# Altium schematic sheet Controler.SchDoc
size A3
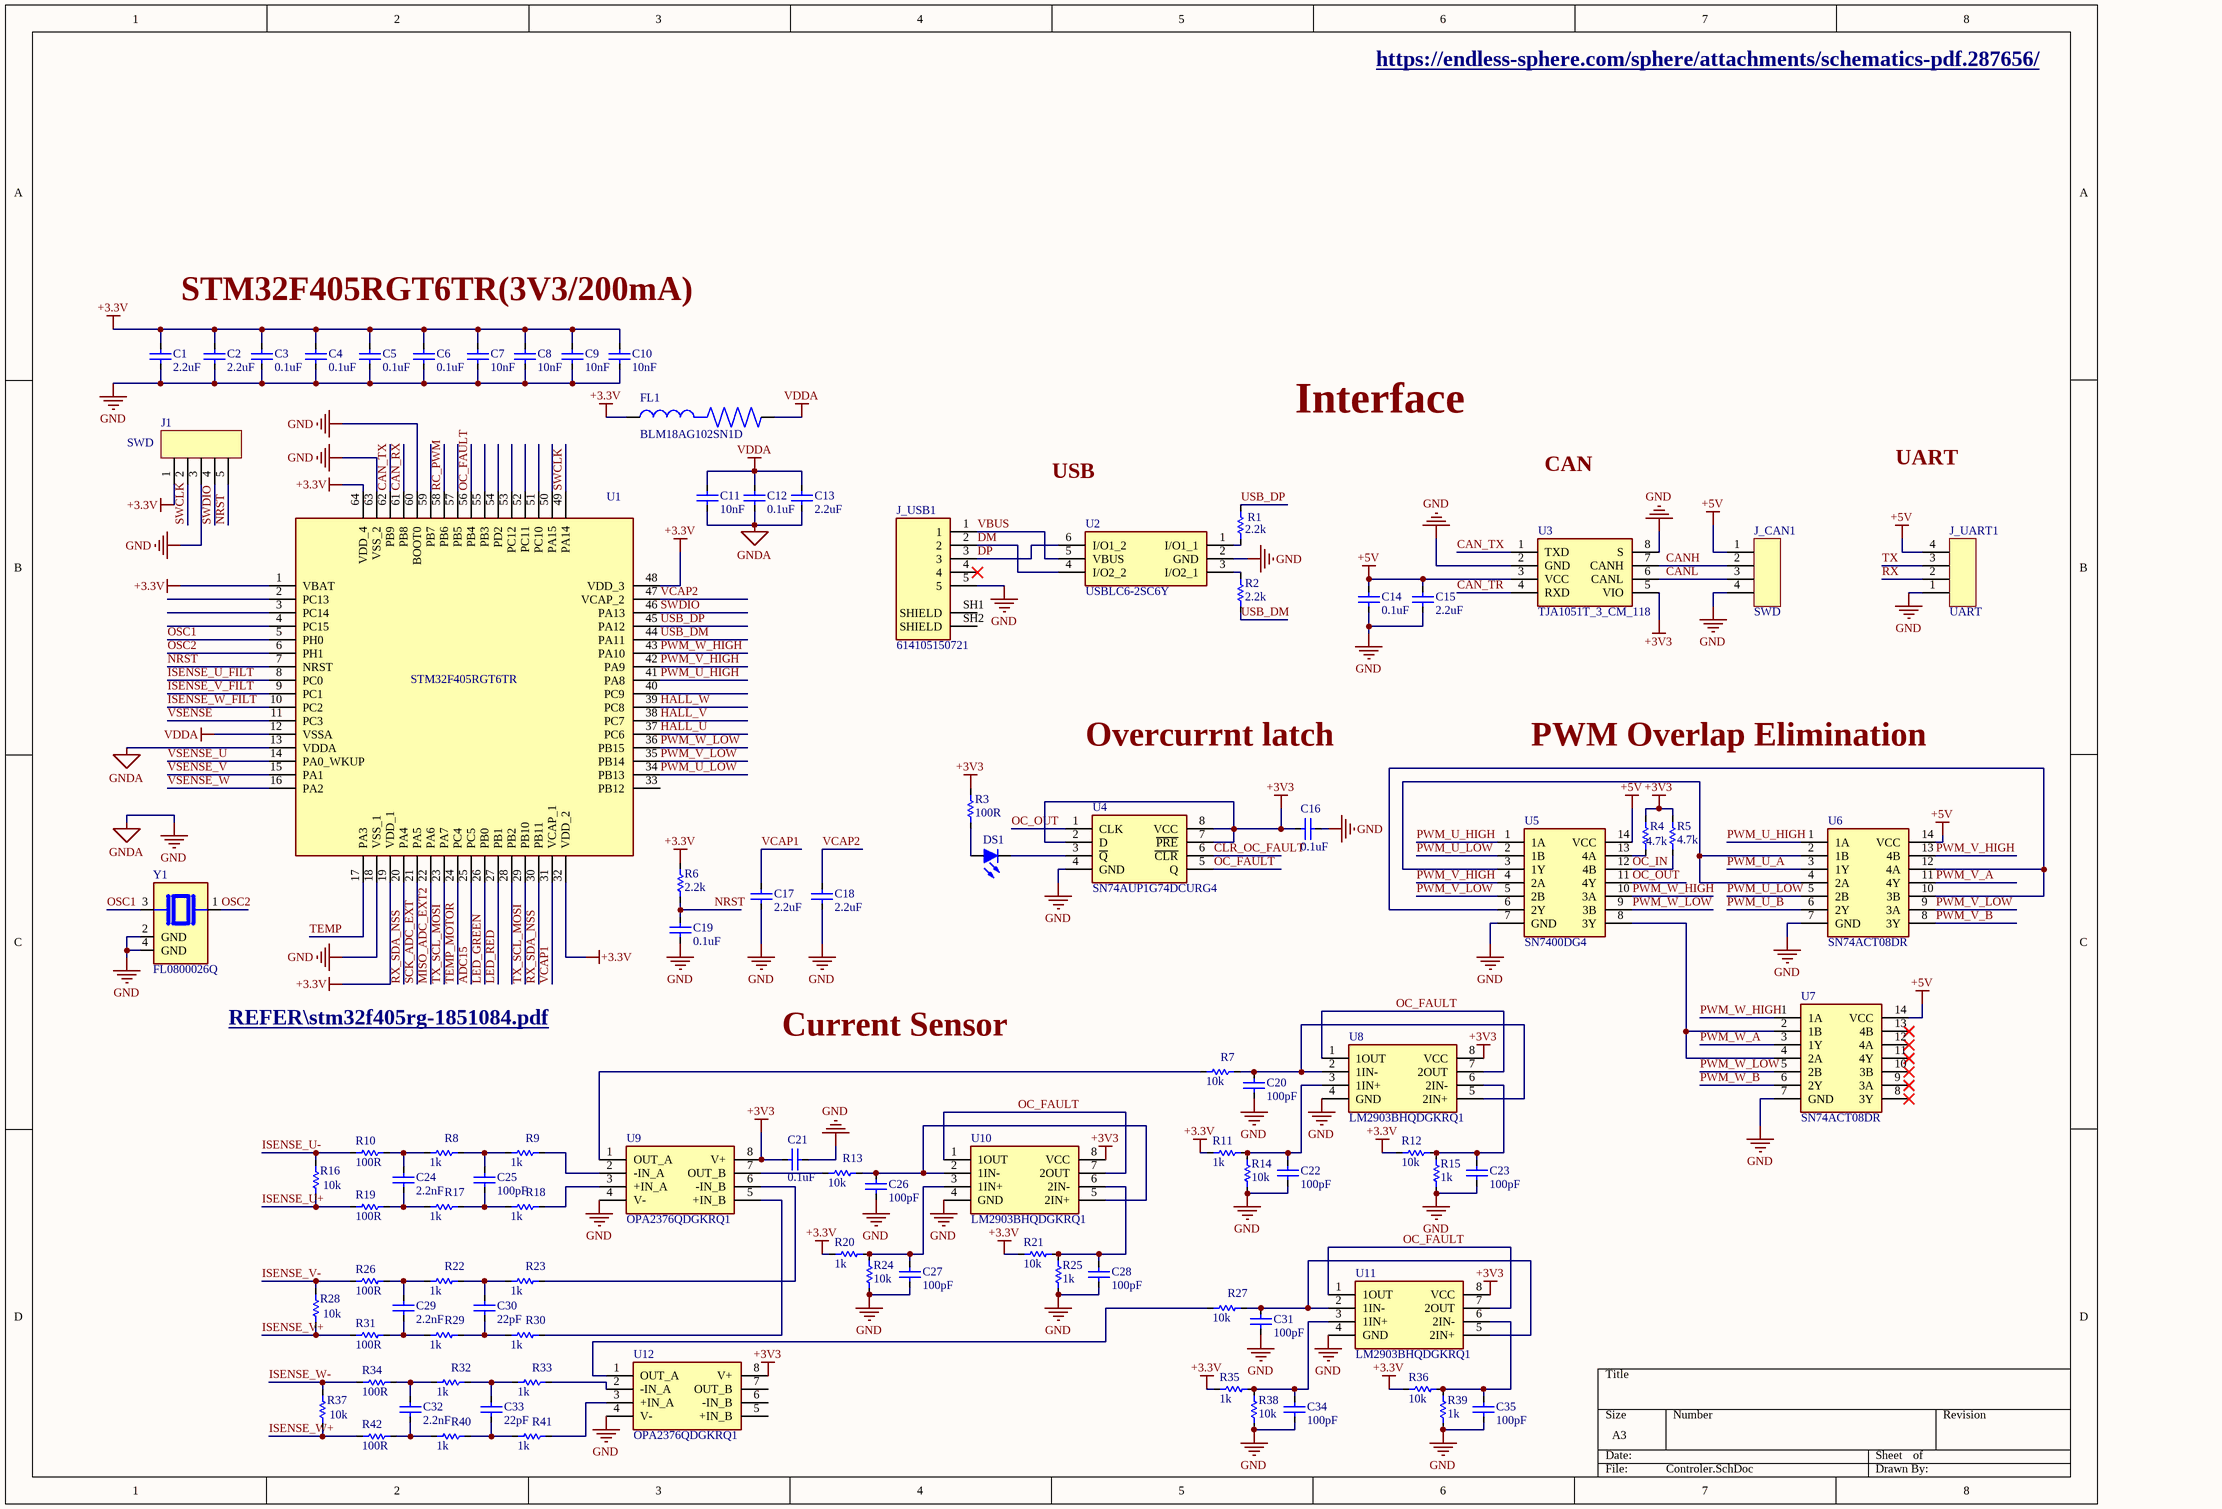
[diagram p0: Controler.SchDoc]

## Parts
C1  2.2uF  [SMD_C(0603)]
C2  2.2uF  [SMD_C(0603)]
C3  0.1uF  [SMD_C(0402)]
C4  0.1uF  [SMD_C(0402)]
C5  0.1uF  [SMD_C(0402)]
C6  0.1uF  [SMD_C(0402)]
C7  10nF  [SMD_C(0402)]
C8  10nF  [SMD_C(0402)]
C9  10nF  [SMD_C(0402)]
C10  10nF  [SMD_C(0402)]
C11  10nF  [SMD_C(0402)]
C12  0.1uF  [SMD_C(0402)]
C13  2.2uF  [SMD_C(0603)]
C14  0.1uF  [SMD_C(0402)]
C15  2.2uF  [SMD_C(0603)]
C16  0.1uF  [SMD_C(0402)]
C17  2.2uF  [SMD_C(0603)]
C18  2.2uF  [SMD_C(0603)]
C19  0.1uF  [SMD_C(0402)]
C20  100pF  [SMD_C(0402)]
C21  0.1uF  [SMD_C(0402)]
C22  100pF  [SMD_C(0402)]
C23  100pF  [SMD_C(0402)]
C24  2.2nF  [SMD_C(0402)]
C25  100pF  [SMD_C(0402)]
C26  100pF  [SMD_C(0402)]
C27  100pF  [SMD_C(0402)]
C28  100pF  [SMD_C(0402)]
C29  2.2nF  [SMD_C(0402)]
C30  22pF  [SMD_C(0402)]
C31  100pF  [SMD_C(0402)]
C32  2.2nF  [SMD_C(0402)]
C33  22pF  [SMD_C(0402)]
C34  100pF  [SMD_C(0402)]
C35  100pF  [SMD_C(0402)]
DS1  SML-D12U1WT86  [LED0603]  (value not drawn)
FL1  BLM18AG102SN1D  [BEADC1608X95N]
J1  SWD  [Header-2.54m-5pin]
J_CAN1  SWD  [Header-2.54m-4pin]
J_UART1  UART  [Header-2.54m-4pin]
J_USB1  614105150721  [WURTH_614105150721]
R1  2.2k  [SMD_R(0402)]
R2  2.2k  [SMD_R(0402)]
R3  100R  [SMD_R(0402)]
R4  4.7k  [SMD_R(0402)]
R5  4.7k  [SMD_R(0402)]
R6  2.2k  [SMD_R(0402)]
R7  10k  [SMD_R(0402)]
R8  1k  [SMD_R(0402)]
R9  1k  [SMD_R(0402)]
R10  100R  [SMD_R(0402)]
R11  1k  [SMD_R(0402)]
R12  10k  [SMD_R(0402)]
R13  10k  [SMD_R(0402)]
R14  10k  [SMD_R(0402)]
R15  1k  [SMD_R(0402)]
R16  10k  [SMD_R(0402)]
R17  1k  [SMD_R(0402)]
R18  1k  [SMD_R(0402)]
R19  100R  [SMD_R(0402)]
R20  1k  [SMD_R(0402)]
R21  10k  [SMD_R(0402)]
R22  1k  [SMD_R(0402)]
R23  1k  [SMD_R(0402)]
R24  10k  [SMD_R(0402)]
R25  1k  [SMD_R(0402)]
R26  100R  [SMD_R(0402)]
R27  10k  [SMD_R(0402)]
R28  10k  [SMD_R(0402)]
R29  1k  [SMD_R(0402)]
R30  1k  [SMD_R(0402)]
R31  100R  [SMD_R(0402)]
R32  1k  [SMD_R(0402)]
R33  1k  [SMD_R(0402)]
R34  100R  [SMD_R(0402)]
R35  1k  [SMD_R(0402)]
R36  10k  [SMD_R(0402)]
R37  10k  [SMD_R(0402)]
R38  10k  [SMD_R(0402)]
R39  1k  [SMD_R(0402)]
R40  1k  [SMD_R(0402)]
R41  1k  [SMD_R(0402)]
R42  100R  [SMD_R(0402)]
U1  STM32F405RGT6TR  [QFP50P1200X1200X160-64N]
U2  USBLC6-2SC6Y  [SOT95P280X145-6N]
U3  TJA1051T_3_CM_118  [SOIC127P600X175-8N]
U4  SN74AUP1G74DCURG4  [SOP50P310X90-8N]
U5  SN7400DG4  [SOIC127P600X175-14N]
U6  SN74ACT08DR  [SOIC127P600X175-14N]
U7  SN74ACT08DR  [SOIC127P600X175-14N]
U8  LM2903BHQDGKRQ1  [SOP65P490X110-8N]
U9  OPA2376QDGKRQ1  [SOP65P490X110-8N]
U10  LM2903BHQDGKRQ1  [SOP65P490X110-8N]
U11  LM2903BHQDGKRQ1  [SOP65P490X110-8N]
U12  OPA2376QDGKRQ1  [SOP65P490X110-8N]
Y1  FL0800026Q  [XTAL_FL0800026Q]

## Nets
+3.3V: C1.2 C2.2 C3.2 C4.2 C5.2 C6.2 C7.2 C8.2 C9.2 C10.2 FL1.1 J1.1 R6.2 R11.1 R12.1 R20.1 R21.1 R35.1 R36.1 U1.1(VBAT) U1.19(VDD_1) U1.32(VDD_2) U1.48(VDD_3) U1.64(VDD_4)
+3V3: C16.2 C21.1 R3.2 R4.2 R5.2 U3.5(VIO) U4.2(D) U4.7(~{PRE}) U4.8(VCC) U8.8(VCC) U9.8(V+) U10.8(VCC) U11.8(VCC) U12.8(V+)
+5V: C14.2 C15.2 J_CAN1.1 J_UART1.4 U3.3(VCC) U5.14(VCC) U6.14(VCC) U7.14(VCC)
GND: C1.1 C2.1 C3.1 C4.1 C5.1 C6.1 C7.1 C8.1 C9.1 C10.1 C11.1 C12.1 C13.1 C14.1 C15.1 C16.1 C17.1 C18.1 C19.1 C20.1 C21.2 C22.1 C23.1 C26.1 C27.1 C28.1 C31.1 C34.1 C35.1 J1.3 J_CAN1.4 J_UART1.1 J_USB1.5 R14.2 R15.2 R24.2 R25.2 R38.2 R39.2 U1.13(VDDA) U1.18(VSS_1) U1.60(BOOT0) U1.63(VSS_2) U2.2(GND) U3.2(GND) U3.8(S) U4.4(GND) U5.7(GND) U6.7(GND) U7.7(GND) U8.4(GND) U9.4(V-) U10.4(GND) U11.4(GND) U12.4(V-) Y1.2(GND) Y1.4(GND)  [also labelled GNDA]
VDDA: C11.2 C12.2 C13.2 FL1.2 U1.12(VSSA)
ADC15: U1.25(PC5)
CAN_RX: U1.61(PB8)
CAN_TR: U3.4(RXD)
CAN_TX: U1.62(PB9) U3.1(TXD)
CANH: J_CAN1.2 U3.7(CANH)
CANL: J_CAN1.3 U3.6(CANL)
CLR_OC_FAULT: U4.6(~{CLR})
DM: J_USB1.2 U2.4(I/O2_2)
DP: J_USB1.3 U2.6(I/O1_2)
HALL_U: U1.37(PC6)
HALL_V: U1.38(PC7)
HALL_W: U1.39(PC8)
ISENSE_U+: R16.2 R19.2
ISENSE_U-: R10.2 R16.1
ISENSE_U_FILT: U1.8(PC0)
ISENSE_V+: R28.2 R31.2
ISENSE_V-: R26.2 R28.1
ISENSE_V_FILT: U1.9(PC1)
ISENSE_W+: R37.2 R42.2
ISENSE_W-: R34.2 R37.1
ISENSE_W_FILT: U1.10(PC2)
LED_GREEN: U1.26(PB0)
LED_RED: U1.27(PB1)
MISO_ADC_EXT2: U1.22(PA6)
NRST: C19.2 J1.5 R6.1 U1.7(NRST)
OC_FAULT: U1.56(PB4) U4.5(Q) U8.1(1OUT) U8.7(2OUT) U10.1(1OUT) U10.7(2OUT) U11.1(1OUT) U11.7(2OUT)
OC_IN: R5.1 U5.12(4B)
OC_OUT: U4.1(CLK) U5.11(4Y)
OSC1: U1.5(PH0) Y1.3
OSC2: U1.6(PH1) Y1.1
PWM_U_A: U6.3(1Y)
PWM_U_B: U6.6(2Y)
PWM_U_HIGH: U1.41(PA8) U5.1(1A) U6.1(1A)
PWM_U_LOW: U1.34(PB13) U5.2(1B) U6.5(2B)
PWM_V_A: U6.11(4Y)
PWM_V_B: U6.8(3Y)
PWM_V_HIGH: U1.42(PA9) U5.4(2A) U6.13(4B)
PWM_V_LOW: U1.35(PB14) U5.5(2B) U6.9(3A)
PWM_W_A: U7.3(1Y)
PWM_W_B: U7.6(2Y)
PWM_W_HIGH: U1.43(PA10) U5.10(3A) U7.1(1A)
PWM_W_LOW: U1.36(PB15) U5.9(3B) U7.5(2B)
RC_PWM: U1.58(PB6)
RX: J_UART1.2
RX_SDA_NSS: U1.20(PA4) U1.30(PB11)
SCK_ADC_EXT: U1.21(PA5)
SWCLK: J1.2 U1.49(PA14)
SWDIO: J1.4 U1.46(PA13)
TEMP: U1.17(PA3)
TEMP_MOTOR: U1.24(PC4)
TX: J_UART1.3
TX_SCL_MOSI: U1.23(PA7) U1.29(PB10)
USB_DM: R2.2 U1.44(PA11)
USB_DP: R1.2 U1.45(PA12)
VBUS: J_USB1.1 U2.5(VBUS)
VCAP1: C17.2 U1.31(VCAP_1)
VCAP2: C18.2 U1.47(VCAP_2)
VSENSE: U1.11(PC3)
VSENSE_U: U1.14(PA0_WKUP)
VSENSE_V: U1.15(PA1)
VSENSE_W: U1.16(PA2)
NetC20_2: C20.2 R7.1 U8.2(1IN-) U8.5(2IN+)
NetC22_2: C22.2 R11.2 R14.1 U8.3(1IN+)
NetC23_2: C23.2 R12.2 R15.1 U8.6(2IN-)
NetC24_1: C24.1 R17.2 R19.1
NetC24_2: C24.2 R8.2 R10.1
NetC25_1: C25.1 R17.1 R18.2
NetC25_2: C25.2 R8.1 R9.2
NetC26_2: C26.2 R13.1 U10.2(1IN-) U10.5(2IN+)
NetC27_2: C27.2 R20.2 R24.1 U10.3(1IN+)
NetC28_2: C28.2 R21.2 R25.1 U10.6(2IN-)
NetC29_1: C29.1 R29.2 R31.1
NetC29_2: C29.2 R22.2 R26.1
NetC30_1: C30.1 R29.1 R30.2
NetC30_2: C30.2 R22.1 R23.2
NetC31_2: C31.2 R27.1 U11.2(1IN-) U11.5(2IN+)
NetC32_1: C32.1 R40.2 R42.1
NetC32_2: C32.2 R32.2 R34.1
NetC33_1: C33.1 R40.1 R41.2
NetC33_2: C33.2 R32.1 R33.2
NetC34_2: C34.2 R35.2 R38.1 U11.3(1IN+)
NetC35_2: C35.2 R36.2 R39.1 U11.6(2IN-)
NetDS1_A: DS1.A R3.1
NetDS1_C: DS1.C U4.3(~{Q})
NetR1_1: R1.1 U2.1(I/O1_1)
NetR2_1: R2.1 U2.3(I/O2_1)
NetR4_1: R4.1 U5.13(4A)
NetR7_2: R7.2 U9.1(OUT_A)
NetR9_1: R9.1 U9.2(-IN_A)
NetR13_2: R13.2 U9.7(OUT_B)
NetR18_1: R18.1 U9.3(+IN_A)
NetR23_1: R23.1 U9.6(-IN_B)
NetR27_2: R27.2 U12.1(OUT_A)
NetR30_1: R30.1 U9.5(+IN_B)
NetR33_1: R33.1 U12.2(-IN_A)
NetR41_1: R41.1 U12.3(+IN_A)
NetU5_3: U5.3(1Y) U6.2(1B) U6.4(2A)
NetU5_6: U5.6(2Y) U6.10(3B) U6.12(4A)
NetU5_8: U5.8(3Y) U7.2(1B) U7.4(2A)

Not connected (* = marked no-connect by the designer): J_USB1 4* SH1(SHIELD) SH2(SHIELD); U1 2(PC13) 3(PC14) 4(PC15) 28(PB2) 33(PB12) 40(PC9) 50(PA15) 51(PC10) 52(PC11) 53(PC12) 54(PD2) 55(PB3) 57(PB5) 59(PB7); U7 8(3Y)* 9(3A)* 10(3B)* 11(4Y)* 12(4A)* 13(4B)*; U12 5(+IN_B) 6(-IN_B) 7(OUT_B)

## Notes on the sheet
- https://endless-sphere.com/sphere/attachments/schematics-pdf.287656/
- STM32F405RGT6TR(3V3/200mA)
- Interface
- USB
- CAN
- UART
- Overcurrnt latch
- PWM Overlap Elimination
- REFER\stm32f405rg-1851084.pdf <F:\TASK\2023\8\VESC_MotorController\REFER\STM32f405rg-1851084.pdf>
- Current Sensor

## Library data of the parts
C1 C2 C13 = Cap_9: PHE840MA6100MA04R17; Manufacturer: Yageo; Manufacturer Part Number: CC0603KPX7R9BB104; Supplier 1: Digi-Key; Supplier Part Number 1: 311-3567-1-ND
C3-C6 C12 C14 C16 C19 C21 = Cap_1: Multilayer Ceramic Capacitors MLCC - SMD/SMT 50 V 0.1uF X7R 0603 10%; Manufacturer: Yageo; Manufacturer Part Number: CC0603KPX7R9BB104; Supplier 1: Digi-Key; Supplier Part Number 1: 311-3567-1-ND
C7-C11 = Cap_2: Multilayer Ceramic Capacitors MLCC - SMD/SMT 50 V 10nF X7R 0603 10%; Manufacturer: Yageo; Manufacturer Part Number: CC0603KPX7R9BB103; Supplier 1: Digi-Key; Supplier Part Number 1: 311-3567-1-ND
C15 C17 C18 = Cap_4: Multilayer Ceramic Capacitors MLCC - SMD/SMT 2.2 uF 50 VDC 10% 1206 X7R AEC-Q200; Manufacturer: Yageo; Manufacturer Part Number: GCM31CR71H225KA55K; Supplier 1: Digi-Key; Supplier Part Number 1: 311-3567-1-ND
C20 C22-C35 = Cap_7: PHE840MA6100MA04R17; Manufacturer: Yageo; Manufacturer Part Number: CC0603KPX7R9BB104; Supplier 1: Digi-Key; Supplier Part Number 1: 311-3567-1-ND
DS1 = SML-D12U1WT86: Typical RED GaAs LED; Manufacturer: Rohm Semiconductor; Supplier: Mouser; Supplier Part Number: 755-SML-D12U1WT86; Manufacturer Part Number: SML-D12U1WT86; Value: SML-D12U1WT86; Price: 0.2
FL1 = BLM18AG102SN1D: 1 kOhms @ 100MHz 1 Ferrite Bead 0603 _1608 Metric_ 400mA 500mOhm; MF: Murata; Package: 1608 Murata; MP: BLM18AG102SN1D; Digi-Key_Purchase_URL: https://www.digikey.in/product-detail/en/murata-electronics/BLM18AG102SN1D/490-1015-1-ND/584463?utm_source=snapeda&utm_medium=aggregator&utm_campaign=symbol; Digi-Key_Part_Number: 490-1015-1-ND; Value: *; SnapEDA_Link: https://www.snapeda.com/parts/BLM18AG102SN1D/Murata/view-part/45181/?ref=snap
J1 = 5PinConnector
J_CAN1 J_UART1 = 4PinConnector
J_USB1 = 614105150721: USB - micro B USB 2.0 Receptacle Connector 5 Position Through Hole; MF: Wurth Electronics; Package: None; Digi-Key_Part_Number: 732-5958-1-ND; MP: 614105150721; SnapEDA_Link: https://www.snapeda.com/parts/614105150721/Wurth%20Electronics%20Inc./view-part/1118291/?ref=snap; Value: *; Digi-Key_Purchase_URL: https://www.digikey.com/product-detail/en/w-rth-elektronik/614105150721/732-5958-1-ND/5047553?utm_source=snapeda&utm_medium=aggregator&utm_campaign=symbol
R1 R2 R6 = Res Semi_2: CRCW04024R02FKED; Published: 8-Jun-2000; LatestRevisionDate: 17-Jul-2002; LatestRevisionNote: Re-released for DXP Platform.; PackageReference: AXIAL-0.5; Publisher: Altium Limited; PackageDescription: Axial Device, Thru-Hole; 2 Leads; 0.5 in Pin Spacing
R3 R7-R42 = Res Semi_1: CRCW04024R02FKED; Published: 8-Jun-2000; LatestRevisionDate: 17-Jul-2002; LatestRevisionNote: Re-released for DXP Platform.; PackageReference: AXIAL-0.5; Publisher: Altium Limited; PackageDescription: Axial Device, Thru-Hole; 2 Leads; 0.5 in Pin Spacing
R4 R5 = Res Semi_3: CRCW04024R02FKED; Published: 8-Jun-2000; LatestRevisionDate: 17-Jul-2002; LatestRevisionNote: Re-released for DXP Platform.; PackageReference: AXIAL-0.5; Publisher: Altium Limited; PackageDescription: Axial Device, Thru-Hole; 2 Leads; 0.5 in Pin Spacing
U1 = STM32F405RGT6TR: STM32F405RGT6TR, 32 bit ARM Cortex M4 MCU 168MHz 1024 kB Flash, 192 kB RAM, 2xUSB CAN I2C 64-Pin LQFP; Manufacturer_Name: STMicroelectronics; Geometry.Height: 1.6mm; Mouser Part Number: 511-STM32F405RGT6TR; Mouser Price/Stock: https://www.mouser.co.uk/ProductDetail/STMicroelectronics/STM32F405RGT6TR?qs=MavH1QghrkHshpR6GkvPIg%3D%3D; Manufacturer_Part_Number: STM32F405RGT6TR; Datasheet Link: http://www.st.com/web/en/resource/technical/document/datasheet/DM00037051.pdf
U2 = USBLC6-2SC6Y: Low Cap. ESD Protection Auto SOT-23-6 STMicroelectronics USBLC6-2SC6Y, Dual Uni-Directional TVS Diode Array, 6-Pin SOT-23; Geometry.Height: 1.45mm; Mouser Part Number: 511-USBLC6-2SC6Y; Mouser Price/Stock: https://www.mouser.co.uk/ProductDetail/STMicroelectronics/USBLC6-2SC6Y?qs=gNDSiZmRJS%2FOgDexvXkdow%3D%3D; Manufacturer_Name: STMicroelectronics; Manufacturer_Part_Number: USBLC6-2SC6Y; Datasheet Link: https://componentsearchengine.com/Datasheets/1/USBLC6-2SC6Y.pdf
U3 = TJA1051T_3_CM_118: CAN Interface IC BL Advanced Automotive Analog; Manufacturer_Name: NXP; Manufacturer_Part_Number: TJA1051T/3/CM,118; Geometry.Height: 1.75mm; Mouser Part Number: 771-TJA1051T/3CM118; Mouser Price/Stock: https://www.mouser.co.uk/ProductDetail/NXP-Semiconductors/TJA1051T-3-CM118?qs=5XOdhvmYM0NUkmo%252BpXvJfw%3D%3D; Datasheet Link: http://www.nxp.com/docs/en/data-sheet/TJA1051.pdf
U4 = SN74AUP1G74DCURG4: Flip Flops Lo PWR SNGL Pos Edge Trgrd DType FlipFlop; Manufacturer_Name: Texas Instruments; Geometry.Height: 0.9mm; Mouser Part Number: 595-74AUP1G74DCURG4; Mouser Price/Stock: https://www.mouser.co.uk/ProductDetail/Texas-Instruments/SN74AUP1G74DCURG4?qs=7kv20MEVUlhYDCdFtbMd%2FA%3D%3D; Manufacturer_Part_Number: SN74AUP1G74DCURG4; Datasheet Link: *
U5 = SN7400DG4: NAND Gate 4-Element 2-IN Bipolar 14-Pin SOIC Tube; Manufacturer_Name: Texas Instruments; Geometry.Height: 1.75mm; Mouser Part Number: 595-SN7400DG4; Mouser Price/Stock: https://www.mouser.co.uk/ProductDetail/Texas-Instruments/SN7400DG4?qs=E8lYj0tdJGGtKkNRXTqCCA%3D%3D; Manufacturer_Part_Number: SN7400DG4; Datasheet Link: https://www.arrow.com/en/products/sn7400dg4/texas-instruments
U6 U7 = SN74ACT08DR: Texas Instruments SN74ACT08DR, AND Quad 2 Input AND, 4.5  5.5 V, 14-Pin SOIC; Geometry.Height: 1.75mm; Mouser Part Number: 595-SN74ACT08DR; Mouser Price/Stock: https://www.mouser.co.uk/ProductDetail/Texas-Instruments/SN74ACT08DR?qs=AMJt07B76uu%2FkRdXJtIwhw%3D%3D; Manufacturer_Name: Texas Instruments; Manufacturer_Part_Number: SN74ACT08DR; Datasheet Link: http://www.ti.com/lit/gpn/sn74act08
U8 U10 U11 = LM2903BHQDGKRQ1: Analog Comparators Automotive, dual, differential, commodity comparator; Manufacturer_Name: Texas Instruments; Geometry.Height: 1.1mm; Mouser Part Number: 595-LM2903BHQDGKRQ1; Mouser Price/Stock: https://www.mouser.co.uk/ProductDetail/Texas-Instruments/LM2903BHQDGKRQ1?qs=By6Nw2ByBD2mW87GUmotXw%3D%3D; Manufacturer_Part_Number: LM2903BHQDGKRQ1; Datasheet Link: https://www.ti.com/lit/ds/symlink/lm2903b-q1.pdf?HQS=dis-mous-null-mousermode-dsf-pf-null-wwe&ts=1670767488652&ref_url=https%253A%252F%252Fwww.mouser.de%252F
U9 U12 = OPA2376QDGKRQ1: Low Noise, Low Quiescent Current, Precision Operational Amplifier e-trim/trade; Manufacturer_Name: Texas Instruments; Geometry.Height: 1.1mm; Mouser Part Number: 595-OPA2376QDGKRQ1; Mouser Price/Stock: https://www.mouser.co.uk/ProductDetail/Texas-Instruments/OPA2376QDGKRQ1?qs=zEmsApcVOkU338m46%2F1O7A%3D%3D; Manufacturer_Part_Number: OPA2376QDGKRQ1; Datasheet Link: http://www.ti.com/lit/gpn/opa2376-q1
Y1 = FL0800026Q: 8 MHz Â±30ppm Crystal 8pF 400 Ohms 4-SMD, No Lead; MF: Diodes Incorporated; Package: NON STANDARD-4 Diodes Inc.; Price: None; Check_prices: https://www.snapeda.com/parts/FL0800026Q/Diodes+Inc./view-part/?ref=eda; Value: *; SnapEDA_Link: https://www.snapeda.com/parts/FL0800026Q/Diodes+Inc./view-part/?ref=snap; MP: FL0800026Q; Availability: In Stock; Purchase-URL: https://pricing.snapeda.com/search?q=FL0800026Q&ref=eda